# Altium schematic sheet 09 EMMC.SchDoc
size 420 x 297 mm; Address1: Address1; Address2: Address2; Address3: Address3; Address4: Address4; DocumentNumber: АБВГ.123456.001 Э3; SheetNumber: 9; SheetTotal: 23; Scale: 1:1; DocumentType: Схема электрическая принципиальная; FirstReferrence: АБВГ.123456.001
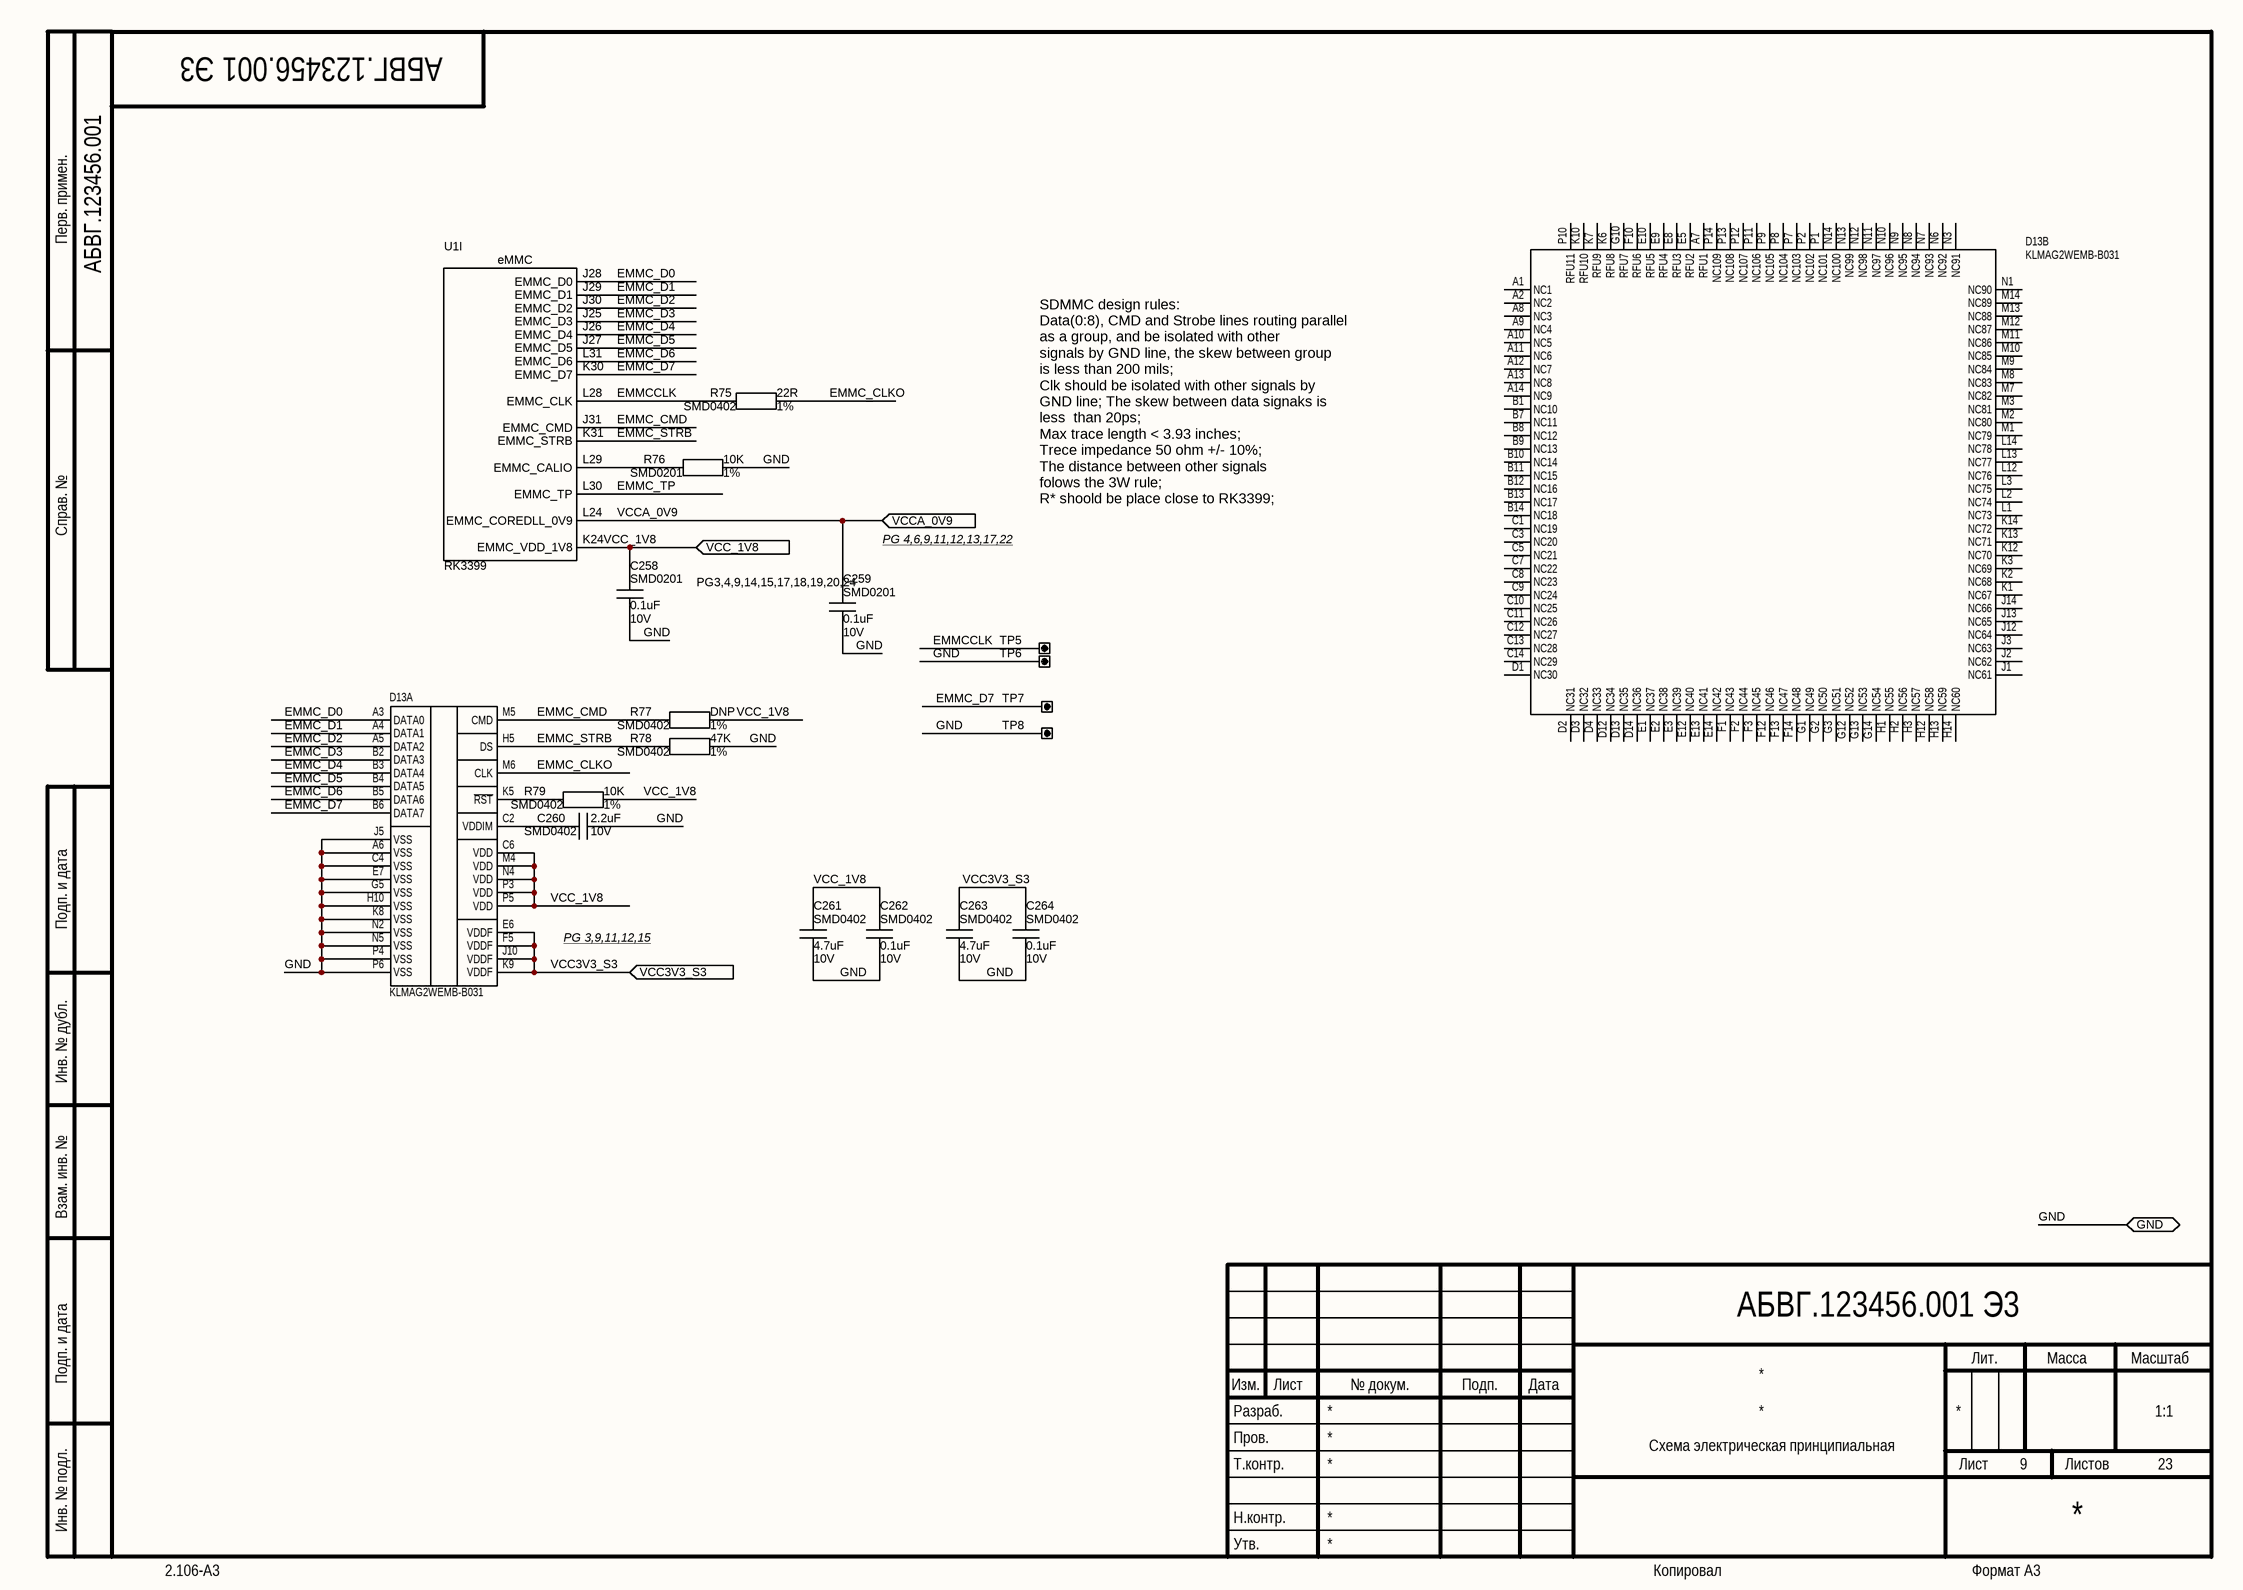
[diagram p0: 09 EMMC.SchDoc]

## Parts
C258  Package: SMD0201  Voltage: 10V  [CAP_SMD_0201]  (hidden comment: 0.1uF)
C259  Package: SMD0201  Voltage: 10V  [CAP_SMD_0201]  (hidden comment: 0.1uF)
C260  Package: SMD0402  Voltage: 10V  [CAP_SMD_0402]  (hidden comment: 2.2uF)
C261  Package: SMD0402  Voltage: 10V  [CAP_SMD_0402]  (hidden comment: 4.7uF)
C262  Package: SMD0402  Voltage: 10V  [CAP_SMD_0402]  (hidden comment: 0.1uF)
C263  Package: SMD0402  Voltage: 10V  [CAP_SMD_0402]  (hidden comment: 4.7uF)
C264  Package: SMD0402  Voltage: 10V  [CAP_SMD_0402]  (hidden comment: 0.1uF)
D13  KLMAG2WEMB-B031  [FBGA153]  (parts A,B of 2)
R75  Package: SMD0402  Tolerance: 1%  [RES_SMD_0402_SMALL]  (hidden comment: 22R)
R76  Package: SMD0201  Tolerance: 1%  [RES_SMD_0201]  (hidden comment: 10K)
R77  Package: SMD0402  Tolerance: 1%  [RES_SMD_0402]  (hidden comment: DNP)
R78  Package: SMD0402  Tolerance: 1%  [RES_SMD_0402]  (hidden comment: 47K)
R79  Package: SMD0402  Tolerance: 1%  [RES_SMD_0402]  (hidden comment: 10K)
TP5  TEST POINT SMD 1MM  [TEST POINT SMD 1MM]  (value not drawn)
TP6  TEST POINT SMD 1MM  [TEST POINT SMD 1MM]  (value not drawn)
TP7  TEST POINT SMD 1MM  [TEST POINT SMD 1MM]  (value not drawn)
TP8  TEST POINT SMD 1MM  [TEST POINT SMD 1MM]  (value not drawn)
U1  value RK3399  [BGA828C65P31X31_2100X2100X161N]  (hidden comment: RK3399_FF)  (part I of 23)

## Ports
GND (bidir), VCC3V3_S3 (in), VCC_1V8 (in), VCCA_0V9 (in)

## Nets
EMMC_CLKO: D13.M6(CLK) R75.1
EMMC_CMD: D13.M5(CMD) R77.1 U1.J31(EMMC_CMD)
EMMC_D0: D13.A3(DATA0) U1.J28(EMMC_D0)
EMMC_D1: D13.A4(DATA1) U1.J29(EMMC_D1)
EMMC_D2: D13.A5(DATA2) U1.J30(EMMC_D2)
EMMC_D3: D13.B2(DATA3) U1.J25(EMMC_D3)
EMMC_D4: D13.B3(DATA4) U1.J26(EMMC_D4)
EMMC_D5: D13.B4(DATA5) U1.J27(EMMC_D5)
EMMC_D6: D13.B5(DATA6) U1.L31(EMMC_D6)
EMMC_D7: D13.B6(DATA7) TP7.1 U1.K30(EMMC_D7)
EMMC_STRB: D13.H5(DS) R78.2 U1.K31(EMMC_STRB)
EMMC_TP: U1.L30(EMMC_TP)
EMMCCLK: R75.2 TP5.1 U1.L28(EMMC_CLK)
GND: C258.2 C259.2 C260.2 C261.1 C262.2 C263.1 C264.2 D13.A6(VSS) D13.C4(VSS) D13.E7(VSS) D13.G5(VSS) D13.H10(VSS) D13.J5(VSS) D13.K8(VSS) D13.N2(VSS) D13.N5(VSS) D13.P4(VSS) D13.P6(VSS) R76.1 R78.1 TP6.1 TP8.1 ; port GND
VCC3V3_S3: C263.2 C264.1 D13.E6(VDDF) D13.F5(VDDF) D13.J10(VDDF) D13.K9(VDDF) ; port VCC3V3_S3
VCC_1V8: C258.1 C261.2 C262.1 D13.C6(VDD) D13.M4(VDD) D13.N4(VDD) D13.P3(VDD) D13.P5(VDD) R77.2 R79.1 U1.K24(EMMC_VDD_1V8) ; port VCC_1V8
VCCA_0V9: C259.1 U1.L24(EMMC_COREDLL_0V9) ; port VCCA_0V9
NetC260_1: C260.1 D13.C2(VDDIM)
NetD13_K5: D13.K5(~{RST}) R79.2
NetR76_2: R76.2 U1.L29(EMMC_CALIO)

Not connected (* = marked no-connect by the designer): D13 A1(NC1) A2(NC2) A7(RFU1) A8(NC3) A9(NC4) A10(NC5) A11(NC6) A12(NC7) A13(NC8) A14(NC9) B1(NC10) B7(NC11) B8(NC12) B9(NC13) B10(NC14) B11(NC15) B12(NC16) B13(NC17) B14(NC18) C1(NC19) C3(NC20) C5(NC21) C7(NC22) C8(NC23) C9(NC24) C10(NC25) C11(NC26) C12(NC27) C13(NC28) C14(NC29) D1(NC30) D2(NC31) D3(NC32) D4(NC33) D12(NC34) D13(NC35) D14(NC36) E1(NC37) E2(NC38) E3(NC39) E5(RFU2) E8(RFU3) E9(RFU4) E10(RFU5) E12(NC40) E13(NC41) E14(NC42) F1(NC43) F2(NC44) F3(NC45) F10(RFU6) F12(NC46) F13(NC47) F14(NC48) G1(NC49) G2(NC50) G3(NC51) G10(RFU7) G12(NC52) G13(NC53) G14(NC54) H1(NC55) H2(NC56) H3(NC57) H12(NC58) H13(NC59) H14(NC60) J1(NC61) J2(NC62) J3(NC63) J12(NC64) J13(NC65) J14(NC66) K1(NC67) K2(NC68) K3(NC69) K6(RFU8) K7(RFU9) K10(RFU10) K12(NC70) K13(NC71) K14(NC72) L1(NC73) L2(NC74) L3(NC75) L12(NC76) L13(NC77) L14(NC78) M1(NC79) M2(NC80) M3(NC81) M7(NC82) M8(NC83) M9(NC84) M10(NC85) M11(NC86) M12(NC87) M13(NC88) M14(NC89) N1(NC90) N3(NC91) N6(NC92) N7(NC93) N8(NC94) N9(NC95) N10(NC96) N11(NC97) N12(NC98) N13(NC99) N14(NC100) P1(NC101) P2(NC102) P7(NC103) P8(NC104) P9(NC105) P10(RFU11) P11(NC106) P12(NC107) P13(NC108) P14(NC109)

## Notes on the sheet
- Перв. примен.
- Справ. №
- SDMMC design rules:
  Data(0:8), CMD and Strobe lines routing parallel
  as a group, and be isolated with other
  signals by GND line, the skew between group
  is less than 200 mils;
  Clk should be isolated with other signals by
  GND line; The skew between data signaks is
  less  than 20ps;
  Max trace length < 3.93 inches;
  Trece impedance 50 ohm +/- 10%;
  The distance between other signals
  folows the 3W rule;
  R* shoold be place close to RK3399;
- PG 4,6,9,11,12,13,17,22
- (near C259) PG3,4,9,14,15,17,18,19,20,24
- Подп. и дата
- PG 3,9,11,12,15
- Инв. № дубл.
- Взам. инв. №
- Разраб.
- Изм.
- Лист
- № докум.
- Подп.
- Дата
- Лит.
- Масса
- Масштаб
- Пров.
- Т.контр.
- Листов
- Инв. № подл.
- Утв.
- Н.контр.
- 2.106-A3
- Копировал
- Формат А3
- (in symbol RK3399_FF, part I) eMMC

## Library data of the parts
C258 C259 = Ceramic_Cap: PartNumber: CC0201KRX5R6BB104; ComponentType: SMD Ceramic Chip Capacitor; Manufacter: *; Tolerance: *; ClassName: *; Value: 0.1uF
C260 = Ceramic_Cap: PartNumber: CC0402KRX5R6BB225; ComponentType: SMD Ceramic Chip Capacitor; Manufacter: *; Tolerance: *; ClassName: *; Value: 2.2uF
C261 C263 = Ceramic_Cap: PartNumber: CL05A475KP5NRNC; ComponentType: SMD Ceramic Chip Capacitor; Manufacter: *; Tolerance: *; ClassName: *; Value: 4.7uF
C262 C264 = Ceramic_Cap: PartNumber: CC0402KRX5R6BB104; ComponentType: SMD Ceramic Chip Capacitor; Manufacter: *; Tolerance: *; ClassName: *; Value: 0.1uF
R75 = Chip_Res: PartNumber: RC0402FR-0722RL; ComponentType: SMD Chip Resistor; Manufacter: *; Voltage: *; ClassName: Solder_Clearence; Value: 22R
R76 = Chip_Res: PartNumber: RC0201FR-0710KL; ComponentType: SMD Chip Resistor; Manufacter: *; Voltage: *; ClassName: *; Value: 10K
R77 = Chip_Res: PartNumber: Do Not Place; ComponentType: SMD Chip Resistor; Manufacter: *; Voltage: *; ClassName: *; Value: DNP
R78 = Chip_Res: PartNumber: RC0402FR-1347KL; ComponentType: SMD Chip Resistor; Manufacter: *; Voltage: *; ClassName: *; Value: 47K
R79 = Chip_Res: PartNumber: RC0402FR-0710KL; ComponentType: SMD Chip Resistor; Manufacter: *; Voltage: *; ClassName: *; Value: 10K
TP5-TP8 = TP: ComponentType: *; Manufacter: *; Package: TEST POINT SMD 1MM; PartNumber: TEST POINT SMD 1MM; ClassName: *; Value: TEST POINT SMD 1MM
D13 = KLMAG2WEMB-B031: ComponentType: *; Manufacter: *; Package: FBGA153; PartNumber: KLMAG2WEMB-B031; ClassName: *; Value: KLMAG2WEMB-B031
U1 = RK3399_FF: Package: BGA828; ComponentType: *; Manufacter: *; PartNumber: RK3399; ClassName: *